# Altium project RT5728MainDriver20181215V0.01.PrjPCB
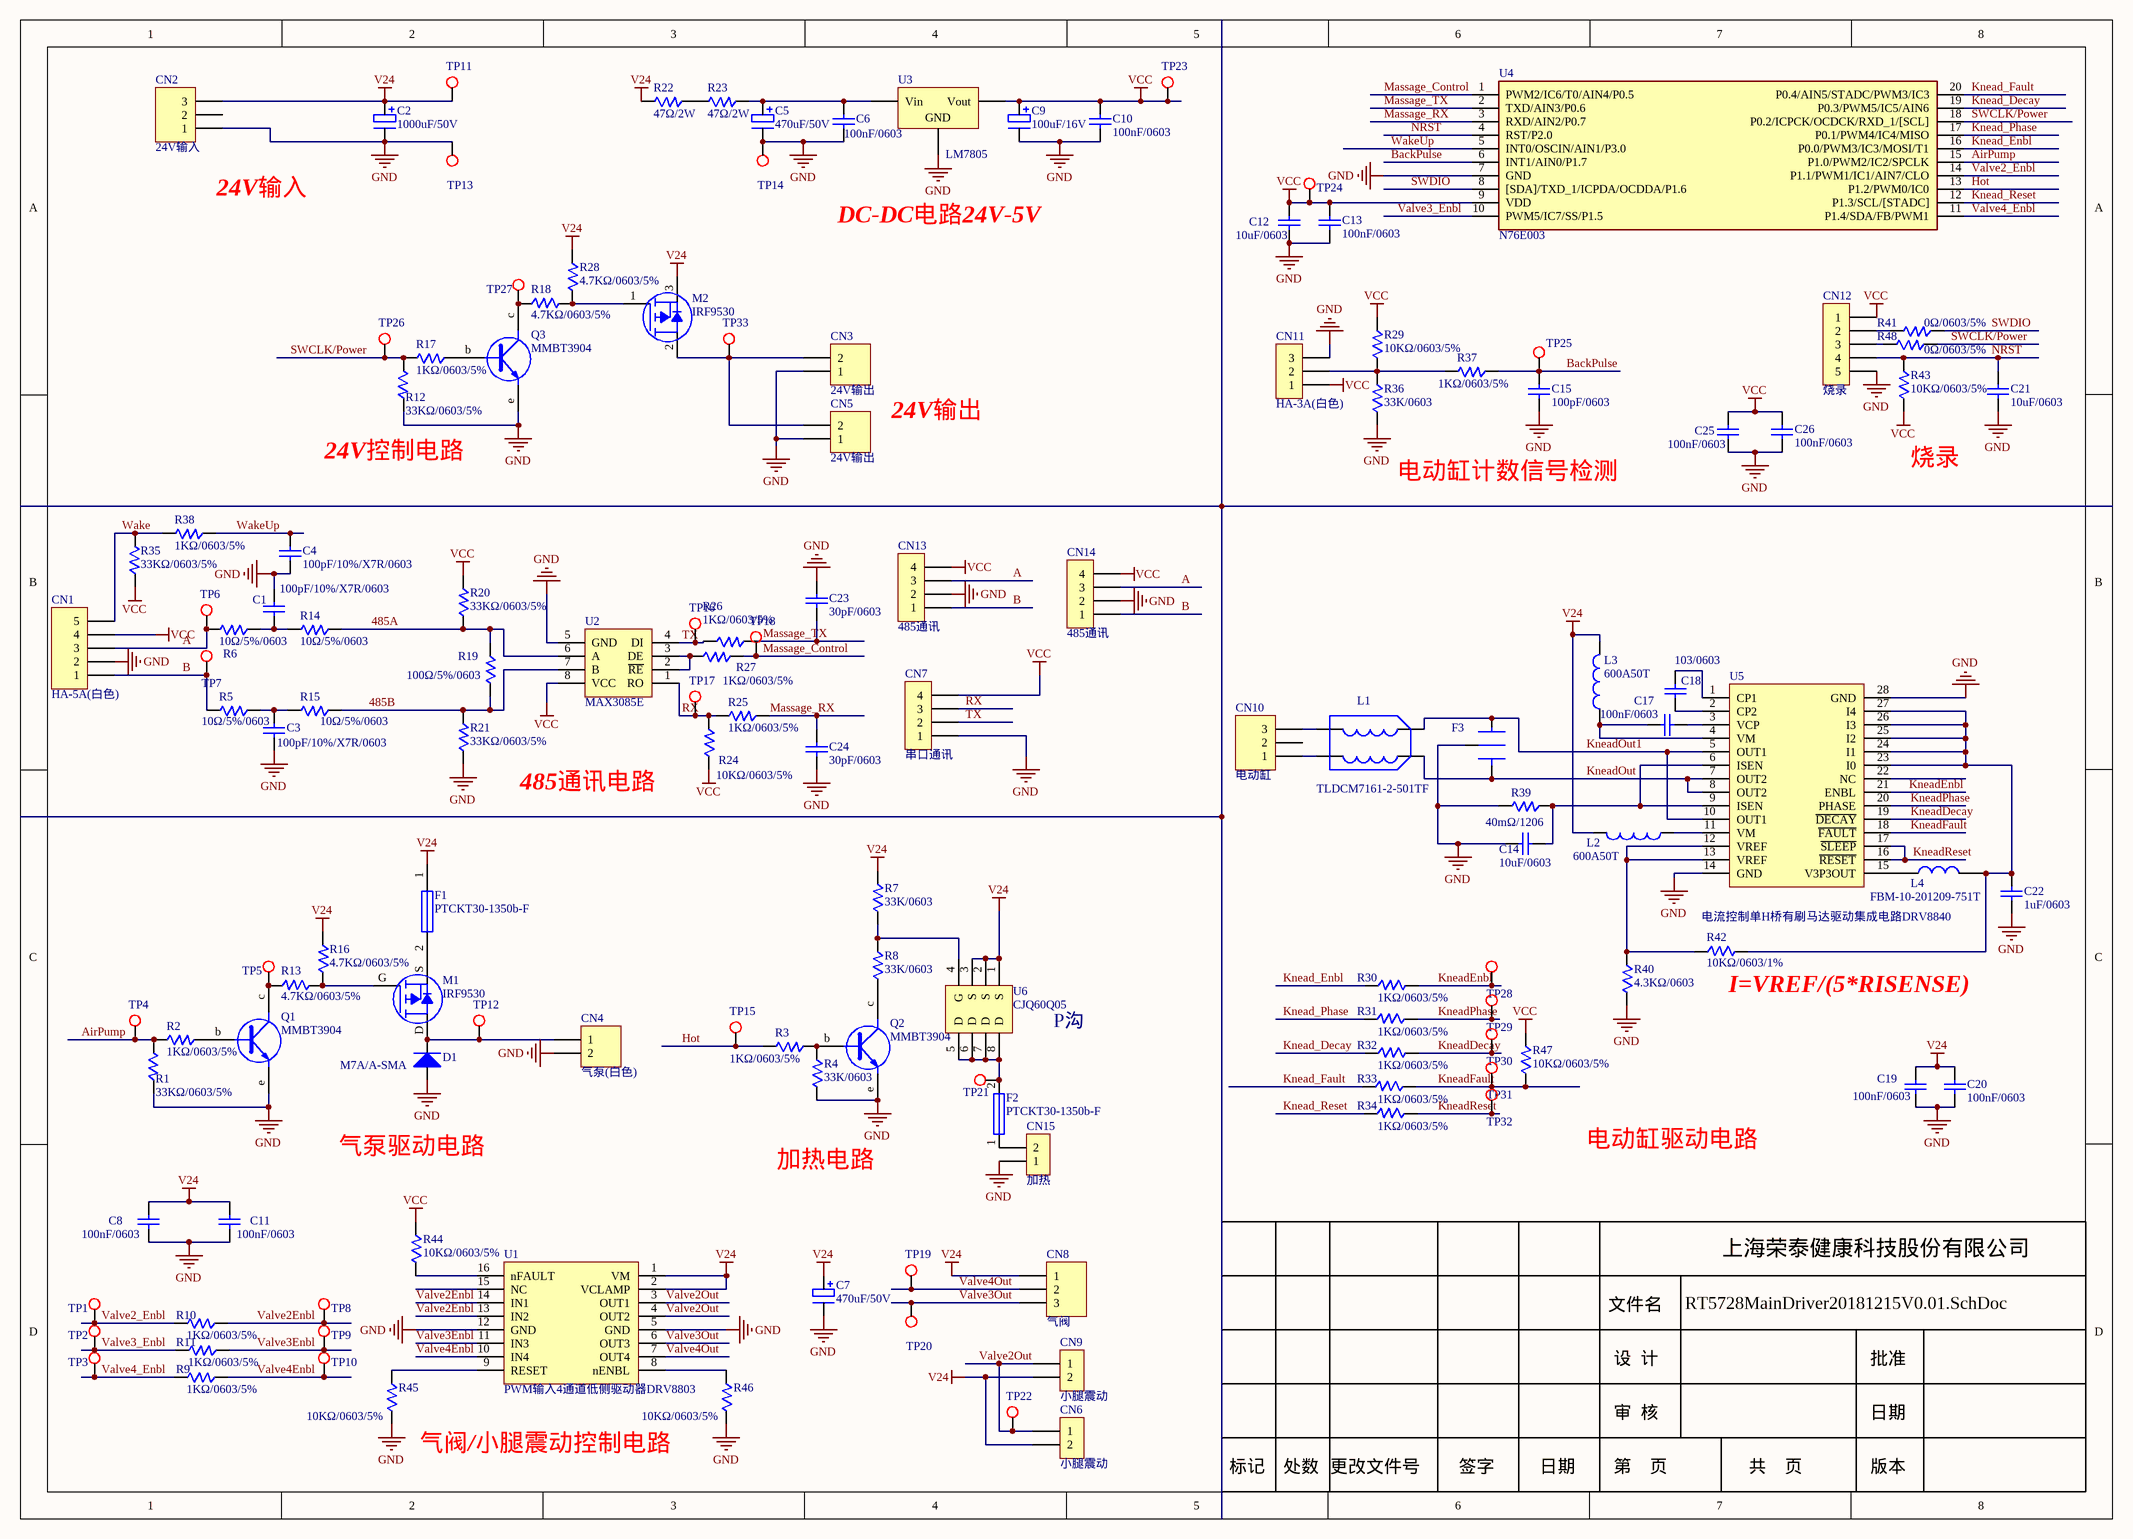
[diagram p0: RT5728MainDriver20181215V0.01.SchDoc]
1 sheet, 141 parts. Net scope: global (net labels, ports and power ports of the same name join across sheets).
Board file: RT5728MainDriver20181215V0.01.PcbDoc

## Sheet RT5728MainDriver20181215V0.01.SchDoc
size A3

### Parts
?  LOGO  [LOGO]  (value not drawn)  (no BOM)
C1  100pF/10%/X7R/0603  [0603C]
C2  1000uF/50V  [RB.3/.6]
C3  100pF/10%/X7R/0603  [0603C]
C4  100pF/10%/X7R/0603  [0603C]
C5  470uF/50V  [RB.2/.4]
C6  100nF/0603  [0603C]
C7  470uF/50V  [RB.2/.4]
C8  100nF/0603  [0603C]
C9  100uF/16V  [RB.1/.2]
C10  100nF/0603  [0603C]
C11  100nF/0603  [0603C]
C12  10uF/0603  [0603C]
C13  100nF/0603  [0603C]
C14  10uF/0603  [0603C]
C15  100pF/0603  [0603C]
C17  100nF/0603  [0603C]
C18  103/0603  [0603C]
C19  100nF/0603  [0603C]
C20  100nF/0603  [0603C]
C21  10uF/0603  [0603C]
C22  1uF/0603  [0603C]
C23  30pF/0603  [0603C]
C24  30pF/0603  [0603C]
C25  100nF/0603  [0603C]
C26  100nF/0603  [0603C]
CN1  HA-5A(白色)  [HA-5A]
CN2  24V输入  [VH-3A2Z - red]
CN3  24V输出  [VH-2 - RED]
CN4  气泵(白色)  [VH-2]
CN5  24V输出  [VH-2 - RED]
CN6  小腿震动  [HA-2A]
CN7  串口通讯  [HA-4A]
CN8  气阀  [VH-3 - white]
CN9  小腿震动  [HA-2A]
CN10  电动缸  [VH-3A2Z - white]
CN11  HA-3A(白色)  [HA-3A]
CN12  烧录  [SIP5]
CN13  485通讯  [HA-4A]
CN14  485通讯  [HA-4A]
CN15  加热  [HA-2A]
D1  M7A/A-SMA  [A-SMA]
F1  PTCKT30-1350b-F  [FRAD0.2]
F2  PTCKT30-1350b-F  [FRAD0.2]
F3  101X15W103MV4T  [0805-X2Y]  (value not drawn)
L1  TLDCM7161-2-501TF  [L-TLDCM7161]
L2  600A50T  [0805L]
L3  600A50T  [0805L]
L4  FBM-10-201209-751T  [0805]
M1  IRF9530  [TO-220AB]
M2  IRF9530  [TO-220S]
Q1  MMBT3904  [SOT-23B]
Q2  MMBT3904  [SOT-23B]
Q3  MMBT3904  [SOT-23B]
R1  33KΩ/0603/5%  [0603]
R2  1KΩ/0603/5%  [0603]
R3  1KΩ/0603/5%  [0603]
R4  33K/0603  [0603]
R5  10Ω/5%/0603  [0603]
R6  10Ω/5%/0603  [0603]
R7  33K/0603  [0603]
R8  33K/0603  [0603]
R9  1KΩ/0603/5%  [0603]
R10  1KΩ/0603/5%  [0603]
R11  1KΩ/0603/5%  [0603]
R12  33KΩ/0603/5%  [0603]
R13  4.7KΩ/0603/5%  [0603]
R14  10Ω/5%/0603  [0603]
R15  10Ω/5%/0603  [0603]
R16  4.7KΩ/0603/5%  [0603]
R17  1KΩ/0603/5%  [0603]
R18  4.7KΩ/0603/5%  [0603]
R19  100Ω/5%/0603  [0603]
R20  33KΩ/0603/5%  [0603]
R21  33KΩ/0603/5%  [0603]
R22  47Ω/2W  [2W-SMALL]
R23  47Ω/2W  [2W-SMALL]
R24  10KΩ/0603/5%  [0603]
R25  1KΩ/0603/5%  [0603]
R26  1KΩ/0603/5%  [0603]
R27  1KΩ/0603/5%  [0603]
R28  4.7KΩ/0603/5%  [0603]
R29  10KΩ/0603/5%  [0603]
R30  1KΩ/0603/5%  [0603]
R31  1KΩ/0603/5%  [0603]
R32  1KΩ/0603/5%  [0603]
R33  1KΩ/0603/5%  [0603]
R34  1KΩ/0603/5%  [0603]
R35  33KΩ/0603/5%  [0603]
R36  33K/0603  [0603]
R37  1KΩ/0603/5%  [0603]
R38  1KΩ/0603/5%  [0603]
R39  40mΩ/1206  [1206]
R40  4.3KΩ/0603  [0603]
R41  0Ω/0603/5%  [0603]
R42  10KΩ/0603/1%  [0603]
R43  10KΩ/0603/5%  [0603]
R44  10KΩ/0603/5%  [0603]
R45  10KΩ/0603/5%  [0603]
R46  10KΩ/0603/5%  [0603]
R47  10KΩ/0603/5%  [0603]
R48  0Ω/0603/5%  [0603]
TP1  TP  [Test Point]  (value not drawn)
TP2  TP  [Test Point]  (value not drawn)
TP3  TP  [Test Point]  (value not drawn)
TP4  TP  [Test Point]  (value not drawn)
TP5  TP  [Test Point]  (value not drawn)
TP6  TP  [Test Point]  (value not drawn)
TP7  TP  [Test Point]  (value not drawn)
TP8  TP  [Test Point]  (value not drawn)
TP9  TP  [Test Point]  (value not drawn)
TP10  TP  [Test Point]  (value not drawn)
TP11  TP  [Test Point]  (value not drawn)
TP12  TP  [Test Point]  (value not drawn)
TP13  TP  [Test Point]  (value not drawn)
TP14  TP  [Test Point]  (value not drawn)
TP15  TP  [Test Point]  (value not drawn)
TP16  TP  [Test Point]  (value not drawn)
TP17  TP  [Test Point]  (value not drawn)
TP18  TP  [Test Point]  (value not drawn)
TP19  TP  [Test Point]  (value not drawn)
TP20  TP  [Test Point]  (value not drawn)
TP21  TP  [Test Point]  (value not drawn)
TP22  TP  [Test Point]  (value not drawn)
TP23  TP  [Test Point]  (value not drawn)
TP24  TP  [Test Point]  (value not drawn)
TP25  TP  [Test Point]  (value not drawn)
TP26  TP  [Test Point]  (value not drawn)
TP27  TP  [Test Point]  (value not drawn)
TP28  TP  [Test Point]  (value not drawn)
TP29  TP  [Test Point]  (value not drawn)
TP30  TP  [Test Point]  (value not drawn)
TP31  TP  [Test Point]  (value not drawn)
TP32  TP  [Test Point]  (value not drawn)
TP33  TP  [Test Point]  (value not drawn)
U1  PWM输入4通道低侧驱动器DRV8803  [PWP16]
U2  MAX3085E  [SOP8]
U3  LM7805  [TO-252]
U4  N76E003  [TSSOP20]
U5  电流控制单H桥有刷马达驱动集成电路DRV8840  [PWP28]
U6  CJQ60Q05  [SOP8]

### Nets
GND: C1.2 C2.2 C3.1 C4.1 C5.2 C6.2 C7.2 C8.2 C9.2 C10.2 C11.2 C12.1 C13.2 C14.2 C15.1 C19.2 C20.2 C21.1 C22.2 C23.2 C24.1 C25.2 C26.2 CN1.2 CN2.1 CN3.1 CN4.2 CN5.1 CN7.1 CN11.3 CN12.5 CN13.2 CN14.2 CN15.1 D1.A F3.3 Q1.e Q2.e Q3.e R1.2 R4.1 R12.2 R21.1 R36.1 R39.1 R40.1 R45.1 R46.1 TP13.1 TP14.1 U1.5(GND) U1.12(GND) U2.5(GND) U3.2(GND) U4.7(GND) U5.14(GND) U5.28(GND)
V24: C2.1 C7.1 C8.1 C11.1 C19.1 C20.1 CN2.3 CN6.2 CN8.1 CN9.2 F1.1 L2.2 L3.2 M2.3(S) R7.2 R16.2 R22.1 R28.2 TP11.1 U1.1(VM) U1.2(VCLAMP) U6.1(S) U6.2(S) U6.3(S)
VCC: C9.1 C10.1 C12.2 C13.1 C25.1 C26.1 CN1.4 CN7.4 CN11.1 CN12.1 CN13.4 CN14.4 R20.2 R24.1 R29.2 R35.2 R43.1 R44.2 R47.2 TP23.1 TP24.1 U2.8(VCC) U3.3(Vout) U4.9(VDD)
485A: R14.2 R19.2 R20.1 U2.6(A)
485B: R15.2 R19.1 R21.2 U2.7(B)
A: CN1.3 CN13.3 CN14.3 R6.1 TP6.1
AirPump: R1.1 R2.1 TP4.1 U4.15(P1.0/PWM2/IC2/SPCLK)
B: CN1.1 CN13.1 CN14.1 R5.1 TP7.1
BackPulse: C15.2 R37.2 TP25.1 U4.6(INT1/AIN0/P1.7)
Hot: R3.1 TP15.1 U4.13(P1.2/PWM0/IC0)
Knead_Decay: R32.2 U4.19(P0.3/PWM5/IC5/AIN6)
Knead_Enbl: R30.2 U4.16(P0.0/PWM3/IC3/MOSI/T1)
Knead_Fault: R33.2 U4.20(P0.4/AIN5/STADC/PWM3/IC3)
Knead_Phase: R31.2 U4.17(P0.1/PWM4/IC4/MISO)
Knead_Reset: R34.2 U4.12(P1.3/SCL/[STADC])
KneadDecay: R32.1 TP30.1 U5.19(~{DECAY})
KneadEnbl: R30.1 TP28.1 U5.21(ENBL)
KneadFault: R33.1 R47.1 TP31.1 U5.18(~{FAULT})
KneadOut: F3.1 L1.2 U5.7(OUT2) U5.8(OUT2)
KneadOut1: F3.2 L1.1 U5.5(OUT1) U5.10(OUT1)
KneadPhase: R31.1 TP29.1 U5.20(PHASE)
KneadReset: R34.1 TP32.1 U5.16(~{RESET}) U5.17(~{SLEEP})
Massage_Control: R27.2 TP18.1 U4.1(PWM2/IC6/T0/AIN4/P0.5)
Massage_RX: C24.2 R25.2 U4.3(RXD/AIN2/P0.7)
Massage_TX: C23.1 R26.2 U4.2(TXD/AIN3/P0.6)
NRST: C21.2 CN12.4 R43.2 U4.4(RST/P2.0)
RX: CN7.3 R24.2 R25.1 TP17.1 U2.1(RO)
SWCLK/Power: R12.1 R17.1 R48.2 TP26.1 U4.18(P0.2/ICPCK/OCDCK/RXD_1/[SCL])
SWDIO: R41.2 U4.8([SDA]/TXD_1/ICPDA/OCDDA/P1.6)
TX: CN7.2 R26.1 TP16.1 U2.4(DI)
Valve2_Enbl: R10.1 TP1.1 U4.14(P1.1/PWM1/IC1/AIN7/CLO)
Valve2Enbl: R10.2 TP8.1 U1.13(IN2) U1.14(IN1)
Valve2Out: CN6.1 CN9.1 TP22.1 U1.3(OUT1) U1.4(OUT2)
Valve3_Enbl: R11.1 TP2.1 U4.10(PWM5/IC7/SS/P1.5)
Valve3Enbl: R11.2 TP9.1 U1.11(IN3)
Valve3Out: CN8.3 TP20.1 U1.6(OUT3)
Valve4_Enbl: R9.1 TP3.1 U4.11(P1.4/SDA/FB/PWM1)
Valve4Enbl: R9.2 TP10.1 U1.10(IN4)
Valve4Out: CN8.2 TP19.1 U1.7(OUT4)
Wake: CN1.5 R35.1 R38.1
WakeUp: C4.2 R38.2 U4.5(INT0/OSCIN/AIN1/P3.0)
NetC1_1: C1.1 R6.2 R14.1
NetC3_2: C3.2 R5.2 R15.1
NetC5_1: C5.1 C6.1 R23.2 U3.1(Vin)
NetC14_1: C14.1 R39.2 U5.6(ISEN) U5.9(ISEN)
NetC17_1: C17.1 L3.1 U5.4(VM)
NetC17_2: C17.2 U5.3(VCP)
NetC18_1: C18.1 U5.2(CP2)
NetC18_2: C18.2 U5.1(CP1)
NetC22_1: C22.1 L4.2 R42.1 U5.23(I0) U5.24(I1) U5.25(I2) U5.26(I3) U5.27(I4)
NetCN3_2: CN3.2 CN5.2 M2.2(D) TP33.1
NetCN4_1: CN4.1 D1.K M1.D TP12.1
NetCN10_1: CN10.1 L1.3
NetCN10_3: CN10.3 L1.4
NetCN11_2: CN11.2 R29.1 R36.2 R37.1
NetCN12_2: CN12.2 R41.1
NetCN12_3: CN12.3 R48.1
NetCN15_2: CN15.2 F2.1
NetF1_2: F1.2 M1.S
NetF2_2: F2.2 TP21.1 U6.5(D) U6.6(D) U6.7(D) U6.8(D)
NetL2_1: L2.1 U5.11(VM)
NetL4_1: L4.1 U5.15(V3P3OUT)
NetM1_G: M1.G R13.1 R16.1
NetM2_1: M2.1(G) R18.1 R28.1
NetQ1_b: Q1.b R2.2
NetQ1_c: Q1.c R13.2 TP5.1
NetQ2_b: Q2.b R3.2 R4.2
NetQ2_c: Q2.c R8.1
NetQ3_b: Q3.b R17.2
NetQ3_c: Q3.c R18.2 TP27.1
NetR7_1: R7.1 R8.2 U6.4(G)
NetR22_2: R22.2 R23.1
NetR27_1: R27.1 U2.2(~{RE}) U2.3(DE)
NetR40_2: R40.2 R42.2 U5.12(VREF) U5.13(VREF)
NetR44_1: R44.1 U1.16(nFAULT)
NetR45_2: R45.2 U1.9(RESET)
NetR46_2: R46.2 U1.8(nENBL)

Not connected (* = marked no-connect by the designer): CN2 2; CN10 2; U1 15(NC); U5 22(NC)

### Notes on the sheet
- (near CN2) 24V输入
- DC-DC电路24V-5V
- (near R12) 24V控制电路
- 24V输出
- (near R43) 烧录
- 电动缸计数信号检测
- 485通讯电路
- (near R42) I=VREF/(5*RISENSE)
- P沟
- 气泵驱动电路
- 加热电路
- 电动缸驱动电路
- 上海荣泰健康科技股份有限公司
- 文件名
- 设  计
- 批准
- (near R45) 气阀/小腿震动控制电路
- 标记
- 处数
- 更改文件号
- 签字
- 日期
- 审  核
- 第    页
- 共    页
- 版本

### Library data of the parts
? = ROTAI_LOGO
C1 C3 C4 = 贴片电容100pF/(10%)X7R/0603封装/环保: 物料编号: 1.01.25.049; 领料单位: 电子车间; 单位: 个; 仓库/库位: 内5X; 物料名称: 贴片电容100pF/(10%)X7R/0603封装/环保
C2 = 电解电容1000uF/50V/16*26/环保: 物料编号: 1.01.21.042; 领料单位: 电子车间; 单位: 个; 仓库/库位: 内5X; 物料名称: 电解电容1000uF/50V/16*26/环保
C5 C7 = 电解电容470uF/50V/10*20/编带/环保: 物料编号: 1.01.21.036; 领料单位: 电子车间; 单位: 个; 仓库/库位: 内5X; 物料名称: 电解电容470uF/50V/10*20/编带/环保
C6 C8 C10 C11 C13 C17 C19 C20 C25 C26 = 贴片电容100nF（104M）/50V/0603封装/10%/X7R/环保: 物料编号: 1.01.25.056; 领料单位: 电子车间; 单位: 个; 仓库/库位: 内5X; 物料名称: 贴片电容100nF（104M）/50V/0603封装/10%/X7R/环保
C9 = 电解电容100uF/16V/5*11/编带/环保: 物料编号: 1.01.21.021; 领料单位: 电子车间; 单位: 个; 仓库/库位: 内5X; 物料名称: 电解电容100uF/16V/5*11/编带/环保
C12 C14 C21 = 贴片电容106/10uF/6.3V/0603封装/10%/X5R/环保: 物料编号: 1.01.25.055; 领料单位: 电子车间; 单位: 个; 仓库/库位: 内5X; 物料名称: 贴片电容106/10uF/6.3V/0603封装/10%/X5R/环保
C15 = 贴片电容100pF/50V/0603封装/5%/NPO/环保: 物料编号: 1.01.25.049; 领料单位: 电子车间; 单位: 个; 仓库/库位: 内5X; 物料名称: 贴片电容100pF/50V/0603封装/5%/NPO/环保
C18 = 贴片电容103/(10%)/X7R/0603封装/环保: 物料编号: 1.01.25.054; 领料单位: 电子车间; 单位: 个; 仓库/库位: 内5X; 物料名称: 贴片电容103/(10%)/X7R/0603封装/环保
C22 = 贴片电容105M/1uF/16V/0603封装/20%/X5R/环保: 物料名称: 贴片电容105M/16V/0603封装/20%/X5R/环保; 物料编号: 1.01.25.060; 领料单位: 电子车间; 单位: 个; 仓库/库位: 内5X
C23 C24 = 贴片电容30pF/50V/0603封装/5%/NPO/环保: 物料编号: 1.01.25.067; 领料单位: 电子车间; 单位: 个; 仓库/库位: 内5X; 物料名称: 贴片电容30PF/50V/0603封装/5%/NPO/环保
CN1 = 带勾小直脚HA-5A/白色/环保: 物料编号: 1.01.57.876; 领料单位: 电子车间; 单位: 个; 仓库/库位: 内5X; 物料名称: 带勾小直脚HA-5A/白色/环保
CN2 = 大直脚VH-3A2Z(红色)/环保: 物料编号: 1.01.57.513; 领料单位: 电子车间; 单位: 个; 仓库/库位: 内5X; 物料名称: 大直脚VH-3A2Z(红色)/环保
CN3 CN5 = 大直脚VH-2A(红色)/环保: 物料编号: 1.01.57.502; 领料单位: 电子车间; 单位: 个; 仓库/库位: 内5X; 物料名称: 大直脚VH-2A(红色)/环保
CN4 = 大直脚VH-2A(白色)/环保: 物料编号: 1.01.57.500; 领料单位: 电子车间; 单位: 个; 仓库/库位: 内5X; 物料名称: 大直脚VH-2A(白色)/环保
CN6 CN9 = 带勾小直脚HA-2A(白色)/环保: 物料编号: 1.01.57.902; 领料单位: 电子车间; 单位: 个; 仓库/库位: 内5X; 物料名称: 带勾小直脚HA-2A(白色)/环保
CN7 = 带勾小直脚HA-4A(蓝色)/环保: 物料编号: 1.01.57.892; 领料单位: 电子车间; 单位: 个; 仓库/库位: 内5X; 物料名称: 带勾小直脚HA-4A(蓝色)/环保
CN8 = 大直脚VH-3A(白色)/环保: 物料编号: 1.01.57.510; 领料单位: 电子车间; 单位: 个; 仓库/库位: 内5X; 物料名称: 大直脚VH-3A(白色)/环保
CN10 = 大直脚VH-3A2Z(白色)/环保: 物料编号: 1.01.57.512; 领料单位: 电子车间; 单位: 个; 仓库/库位: 内5X; 物料名称: 大直脚VH-3A2Z(白色)/环保
CN11 = 带勾小直脚HA-3A (白色）/环保: 物料编号: 1.01.57.882; 领料单位: 电子车间; 单位: 个; 仓库/库位: 内5X; 物料名称: 带勾小直脚HA-3A (白色）/环保
CN12 = 单排5芯直脚排针/2.54间距: 2.54间距; 物料编号: 不焊?; 标称值: 单排4芯直脚排针/2.54间距
CN13 = 带勾小直脚HA-4A(黑色)/环保: 物料编号: 1.01.57.894; 领料单位: 电子车间; 单位: 个; 仓库/库位: 内5X; 物料名称: 带勾小直脚HA-4A(黑色)/环保
CN14 = 带勾小直脚HA-4A(黄色)/环保: 物料编号: 1.01.57.893; 领料单位: 电子车间; 单位: 个; 仓库/库位: 内5X; 物料名称: 带勾小直脚HA-4A(黄色)/环保
CN15 = 带勾小直脚HA-2A(红色)/环保: 物料编号: 1.01.57.928; 领料单位: 电子车间; 单位: 个; 仓库/库位: 内5X; 物料名称: 带勾小直脚HA-2A(红色)/环保
D1 = 贴片二极管M7A/A-SMA封装/环保: 物料编号: 1.01.33.005; 领料单位: 电子车间; 单位: 个; 仓库/库位: 内5X; 物料名称: 贴片二极管M7A/A-SMA封装/环保
F1 F2 = 自恢复保险PTCKT30-1350b-F/环保: 物料编号: 1.01.38.609; 领料单位: 电子车间; 单位: 个; 仓库/库位: 内5X; 物料名称: 自恢复保险PTCKT30-1350b-F/环保
F3 = X2Y电容101X15W103MV4T: 物料编号: 1.01.51.073; 领料单位: 电子车间; 单位: 个; 仓库/库位: 内5X; 物料名称: X2Y电容101X15W103MV4T
L1 = 共模电感/TLDCM7161-2-501TF/环保: 物料编号: 1.01.51.074; 领料单位: 电子车间; 单位: 个; 仓库/库位: 内5X; 物料名称: 共模电感/TLDCM7161-2-501TF/环保
L2 L3 = 贴片磁珠/FBMA-11-201209-600A50T/0805A封装/环保/EMC: 物料编号: 1.01.51.080; 领料单位: 电子车间; 单位: 个; 仓库/库位: 内5X; 物料名称: 贴片磁珠/FBMA-11-201209-600A50T/0805A封装/环保/EMC
L4 = 贴片磁珠/FBM-10-201209-751T/0805封装/环保: 物料名称: 磁珠/FBM-10-201209-751T/环保; 物料编号: 1.01.51.076; 领料单位: 电子车间; 单位: 个; 仓库/库位: 内5X
M1 M2 = 场效应管(MOS管)IRF9530/环保: 物料编号: 1.01.40.003; 领料单位: 电子车间; 单位: 个; 仓库/库位: 内5X; 物料名称: 场效应管(MOS管)IRF9530/环保
Q1-Q3 = 贴片三极管1AM/MMBT3904/sot-23封装环保: 物料编号: 1.01.33.013; 领料单位: 电子车间; 单位: 个; 仓库/库位: 内5X; 物料名称: 贴片三极管1AM/MMBT3904/sot-23封装环保
R1 R12 R20 R21 R35 = 贴片电阻33K/(5%)/0603封装/环保: 物料编号: 1.01.15.117; 领料单位: 电子车间; 单位: 个; 仓库/库位: 内5X; 物料名称: 贴片电阻33K/(5%)/0603封装/环保
R2 R3 R9-R11 R17 R25-R27 R30-R34 = 贴片电阻1K/(5%)/0603封装/环保: 物料编号: 1.01.15.111; 领料单位: 电子车间; 单位: 个; 仓库/库位: 内5X; 物料名称: 贴片电阻1K/(5%)/0603封装/环保
R4 R7 R8 R36 = R0603/33K: 物料编号: 1.01.15.117; 物料名称: 贴片电阻33K/(5%)/0603封装/环保; 领料单位: 电子车间; 单位: 个; 仓库/库位: 内5X
R5 R6 R14 R15 = 贴片电阻10Ω/精度5%/0603: 物料编号: 1.01.15.120; 物料名称: 贴片电阻10Ω/精度5%/0603封装/环保; 领料单位: 电子车间; 单位: 个; 仓库/库位: 内5X
R13 R16 R18 R28 = 贴片电阻4.7K/(5%)/0603封装/环保: 物料编号: 1.01.15.115; 领料单位: 电子车间; 单位: 个; 仓库/库位: 内5X; 物料名称: 贴片电阻4.7K/(5%)/0603封装/环保
R19 = 贴片电阻100Ω/(5%)0603: 物料编号: 1.01.15.103; 物料名称: 贴片电阻100Ω/(5%)0603封装; 领料单位: 电子车间; 单位: 个; 仓库/库位: 内5X
R22 R23 = 电阻47Ω/2W/环保: 物料编号: 1.01.11.104; 物料名称: 电阻47Ω/2W/环保
R24 R29 R43-R47 = 贴片电阻10kΩ/(5%)0603封装/环保: 物料编号: 1.01.15.105; 领料单位: 个; 仓库/库位: 内5X; 物料名称: 贴片电阻10kΩ/(5%)0603封装/环保
R37 R38 = 贴片电阻1K/(5%)/0603封装/环保: 物料编号: 1.01.15.111; 领料单位: 电子车间; 仓库/库位: 内5X; 单位: 个; 物料名称: 贴片电阻1K/(5%)/0603封装/环保
R39 = 贴片采样电阻/40mΩ/1206/1W/1%/环保: 物料名称: 采样电阻/MFJ06HR040FT/40mΩ/1W/1%/环保; 物料编号: 1.01.15.191
R40 = 贴片电阻4.3KΩ/1%/00603封装/环保: 物料编号: 1.01.15.171; 物料名称: 贴片电阻4.3KΩ/1%/00603封装/环保
R41 R48 = 贴片电阻0Ω/(5%)/0603封装/环保: 物料编号: 1.01.15.124; 领料单位: 电子车间; 单位: 个; 仓库/库位: 内5X; 物料名称: 贴片电阻0Ω/(5%)/0603封装/环保
R42 = 贴片电阻10kΩ(1%)/0603封装/环保: 物料编号: 1.01.15.112; 领料单位: 电子车间; 仓库/库位: 内5X; 单位: 个; 物料名称: 贴片电阻10kΩ(1%)/0603封装/环保
TP1-TP33 = TP: 测试点: TP4
U1 = PWM输入4通道低侧驱动器DRV8803: 物料编号: 1.01.45.544; 领料单位: 电子车间; 单位: 个; 仓库/库位: 内5X; 物料名称: PWM输入4通道低侧驱动器DRV8803
U2 = 贴片集成块MAX3085E: 物料名称: 芯片MAX3085E; 物料编号: 1.01.45.584; 领料单位: 电子车间; 单位: 个; 仓库/库位: 内5X
U3 = 贴片三端稳压管LM7805/环保: 物料编号: 1.01.37.501; 领料单位: 电子车间; 单位: 个; 仓库/库位: 内5X; 物料名称: 贴片三端稳压管LM7805/环保
U4 = 单片机/新唐-N76E003/TSSOP-20封装/环保: 物料编号: 1.01.45.649; 物料名称: 单片机/新唐-N76E003/TSSOP-20封装/环保
U5 = 电流控制单H桥有刷马达驱动集成电路DRV8840: 物料编号: 1.01.41.521; 领料单位: 电子车间; 单位: 个; 仓库/库位: 内5X; 物料名称: 电流控制单H桥有刷马达驱动集成电路DRV8840
U6 = AO4441: P沟道MOS管; 物料编码: 1.01.40.514; 物料名称: P沟道MOS管/CJQ60Q05-CJ-上海展铨/环保